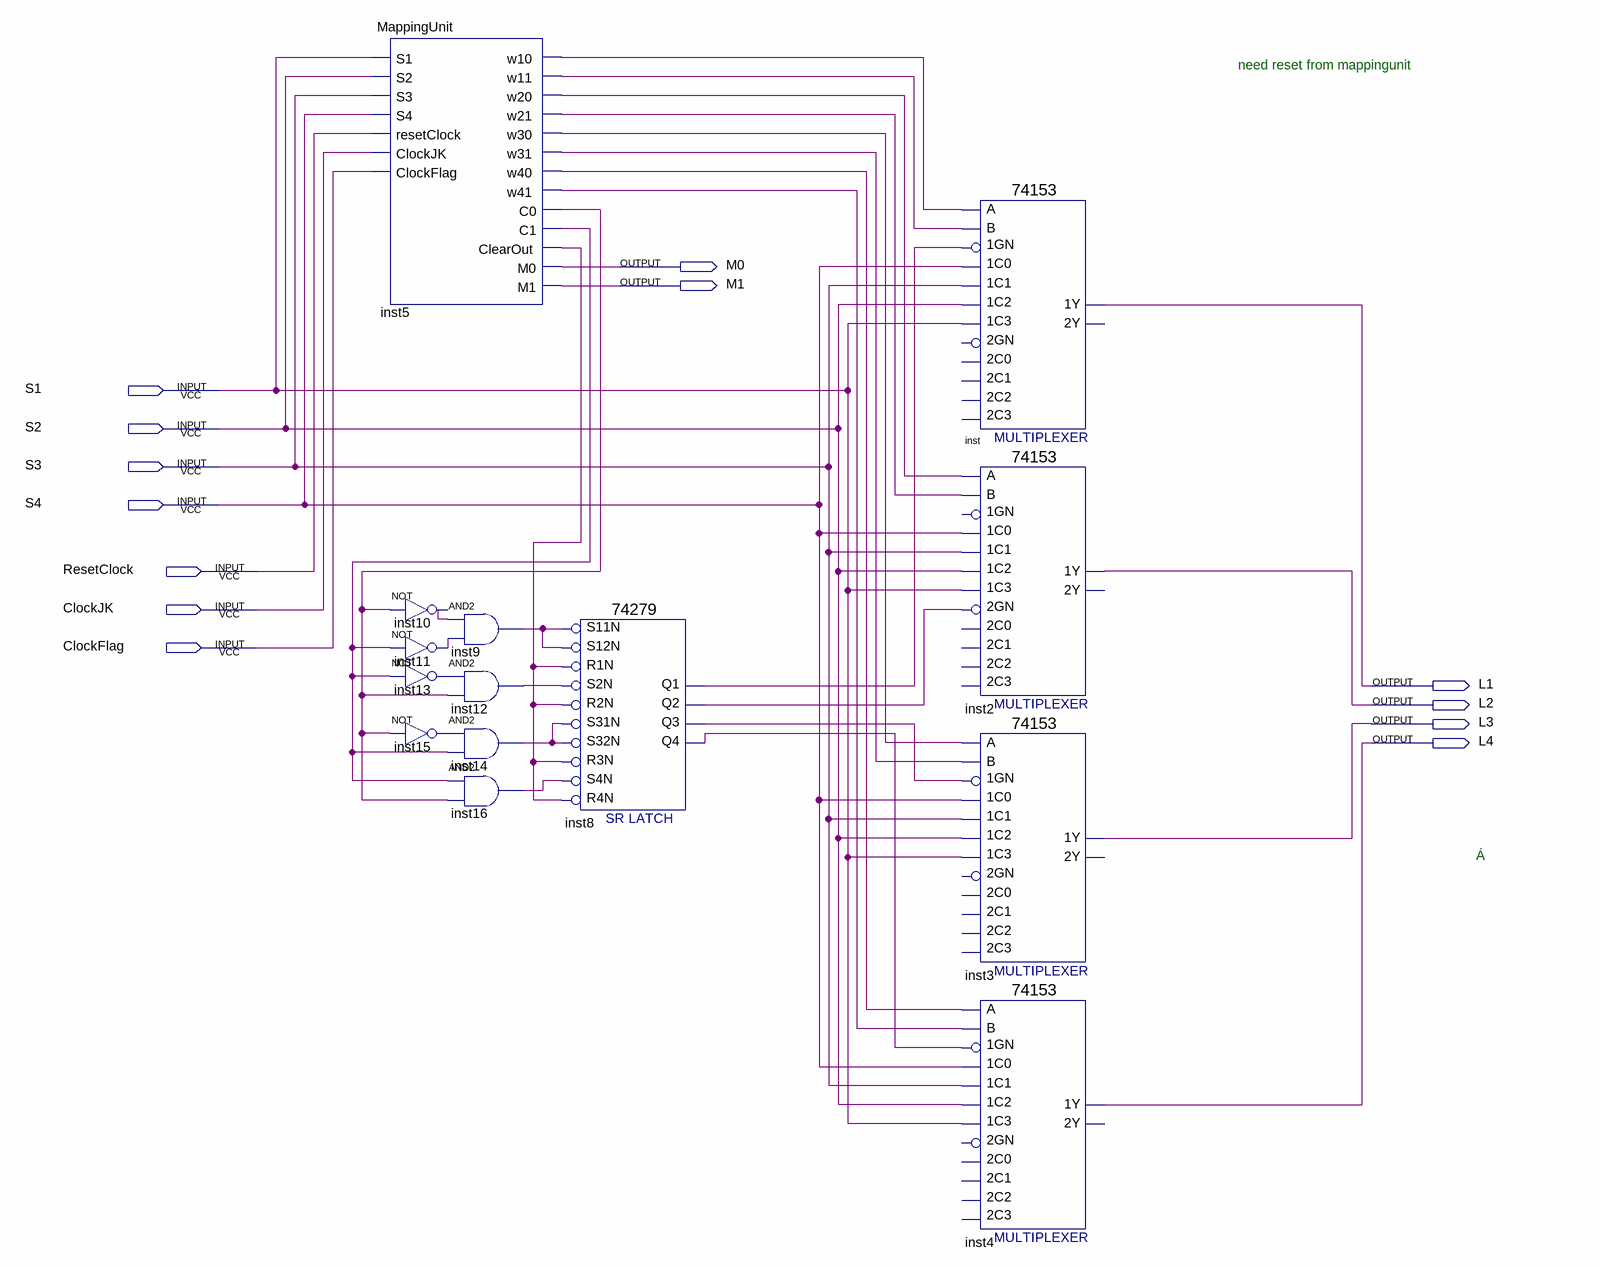
[diagram p0: schematic sheet]
// Quartus schematic SquenceUnit.bdf as structural Verilog: 14 symbols, 13 pins
module SquenceUnit (
  input  S1,
  input  S2,
  input  S3,
  input  S4,
  input  ResetClock,
  input  ClockJK,
  input  ClockFlag,
  output M0,
  output M1,
  output L1,
  output L2,
  output L3,
  output L4
);

  wire inst5_c0, inst5_c1, inst5_clearout, inst5_w10, inst5_w11, inst5_w20, inst5_w21, inst5_w30, inst5_w31,
       inst5_w40, inst5_w41, inst8_q1, inst8_q2, inst8_q3, inst8_q4, inst9_out, inst10_out, inst11_out,
       inst12_out, inst13_out, inst14_out, inst15_out, inst16_out;

  MappingUnit inst5 (
    .S1(S1), .S2(S2), .S3(S3), .S4(S4), .resetClock(ResetClock), .ClockJK(ClockJK), .ClockFlag(ClockFlag),
    .w10(inst5_w10), .w11(inst5_w11), .w20(inst5_w20), .w21(inst5_w21), .w30(inst5_w30), .w31(inst5_w31),
    .w40(inst5_w40), .w41(inst5_w41), .C0(inst5_c0), .C1(inst5_c1), .ClearOut(inst5_clearout), .M0(M0),
    .M1(M1));
  not inst10 (inst10_out, inst5_c0);
  not inst11 (inst11_out, inst5_c1);
  not inst13 (inst13_out, inst5_c1);
  not inst15 (inst15_out, inst5_c0);
  and inst9 (inst9_out, inst10_out, inst11_out);
  and inst12 (inst12_out, inst13_out, inst5_c0);
  and inst14 (inst14_out, inst15_out, inst5_c1);
  and inst16 (inst16_out, inst5_c1, inst5_c0);
  \74279  inst8 (
    .R1N(inst5_clearout), .S12N(inst9_out), .S11N(inst9_out), .R2N(inst5_clearout), .S31N(inst14_out),
    .S32N(inst14_out), .S4N(inst16_out), .R4N(inst5_clearout), .S2N(inst12_out), .R3N(inst5_clearout),
    .Q2(inst8_q2), .Q1(inst8_q1), .Q3(inst8_q3), .Q4(inst8_q4));
  \74153  inst (
    .\1C1 (S3), .\1GN (inst8_q1), .\1C0 (S4), .\1C2 (S2), .\1C3 (S1), .B(inst5_w11), .A(inst5_w10), .\1Y (L1));  // open: 2C0, 2GN, 2C2, 2C1, 2C3, 2Y
  \74153  inst2 (
    .\1C1 (S3), .\1C0 (S4), .\2GN (inst8_q2), .\1C2 (S2), .\1C3 (S1), .B(inst5_w21), .A(inst5_w20), .\1Y (L2));  // open: 1GN, 2C0, 2C2, 2C1, 2C3, 2Y
  \74153  inst3 (
    .\1C1 (S3), .\1GN (inst8_q3), .\1C0 (S4), .\1C2 (S2), .\1C3 (S1), .B(inst5_w31), .A(inst5_w30), .\1Y (L3));  // open: 2C0, 2GN, 2C2, 2C1, 2C3, 2Y
  \74153  inst4 (
    .\1C1 (S3), .\1GN (inst8_q4), .\1C0 (S4), .\1C2 (S2), .\1C3 (S1), .B(inst5_w41), .A(inst5_w40), .\1Y (L4));  // open: 2C0, 2GN, 2C2, 2C1, 2C3, 2Y

  // Notes on the sheet:
  //   need reset from mappingunit
  //   Á
endmodule
